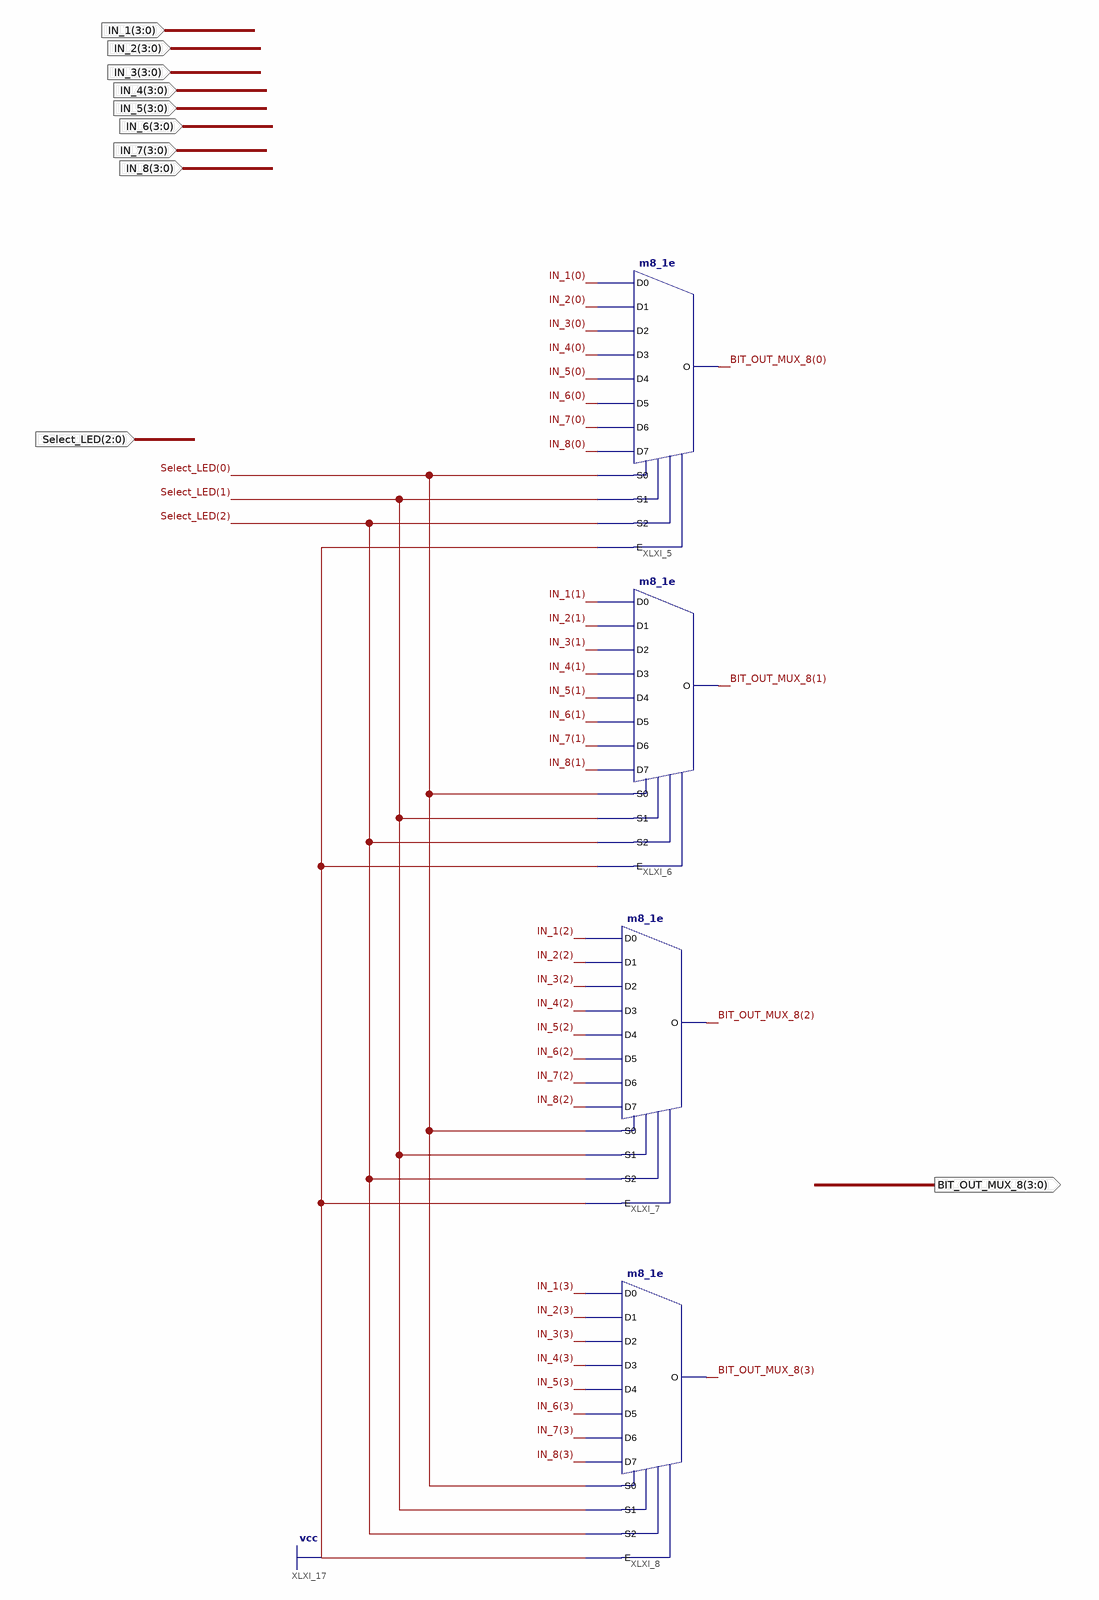
[diagram p0: schematic sheet 1]
// Xilinx ISE schematic Mux8_Swap_8.sch (spartan6) as structural Verilog: 4 symbols, 10 ports
module Mux8_Swap_8 (
  input  [2:0] Select_LED,
  input  [3:0] IN_1,
  input  [3:0] IN_2,
  input  [3:0] IN_3,
  input  [3:0] IN_4,
  input  [3:0] IN_5,
  input  [3:0] IN_6,
  input  [3:0] IN_7,
  input  [3:0] IN_8,
  output [3:0] BIT_OUT_MUX_8
);

  m8_1e XLXI_5 (
    .D0(IN_1[0]), .D1(IN_2[0]), .D2(IN_3[0]), .D3(IN_4[0]), .D4(IN_5[0]), .D5(IN_6[0]), .D6(IN_7[0]),
    .D7(IN_8[0]), .E(1'b1), .S0(Select_LED[0]), .S1(Select_LED[1]), .S2(Select_LED[2]), .O(BIT_OUT_MUX_8[0]));
  m8_1e XLXI_6 (
    .D0(IN_1[1]), .D1(IN_2[1]), .D2(IN_3[1]), .D3(IN_4[1]), .D4(IN_5[1]), .D5(IN_6[1]), .D6(IN_7[1]),
    .D7(IN_8[1]), .E(1'b1), .S0(Select_LED[0]), .S1(Select_LED[1]), .S2(Select_LED[2]), .O(BIT_OUT_MUX_8[1]));
  m8_1e XLXI_7 (
    .D0(IN_1[2]), .D1(IN_2[2]), .D2(IN_3[2]), .D3(IN_4[2]), .D4(IN_5[2]), .D5(IN_6[2]), .D6(IN_7[2]),
    .D7(IN_8[2]), .E(1'b1), .S0(Select_LED[0]), .S1(Select_LED[1]), .S2(Select_LED[2]), .O(BIT_OUT_MUX_8[2]));
  m8_1e XLXI_8 (
    .D0(IN_1[3]), .D1(IN_2[3]), .D2(IN_3[3]), .D3(IN_4[3]), .D4(IN_5[3]), .D5(IN_6[3]), .D6(IN_7[3]),
    .D7(IN_8[3]), .E(1'b1), .S0(Select_LED[0]), .S1(Select_LED[1]), .S2(Select_LED[2]), .O(BIT_OUT_MUX_8[3]));
endmodule
